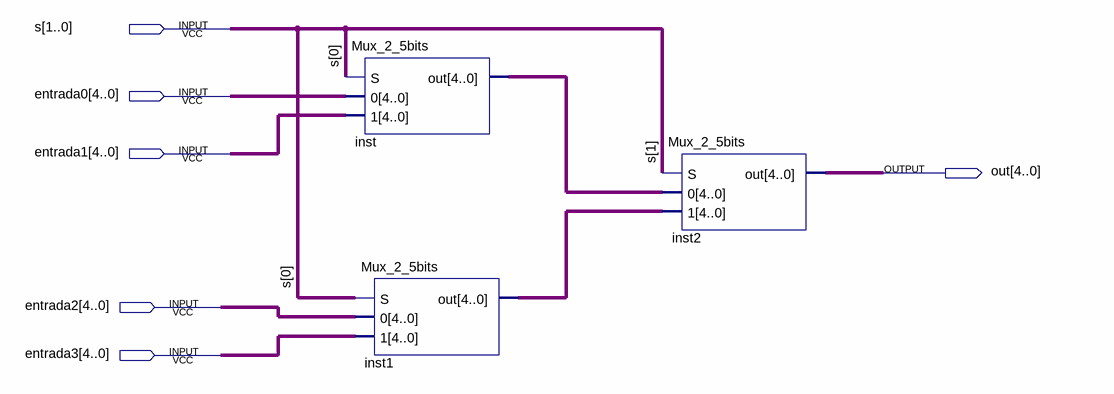
[diagram p0: schematic sheet]
// Quartus schematic Mux_4_5bits.bdf as structural Verilog: 3 symbols, 6 pins
module Mux_4_5bits (
  input  [1:0] s,
  input  [4:0] entrada0,
  input  [4:0] entrada1,
  input  [4:0] entrada2,
  input  [4:0] entrada3,
  output [4:0] out
);

  wire [4:0] inst1_out, inst_out;

  Mux_2_5bits inst (.S(s[0]), .\0 (entrada0), .\1 (entrada1), .out(inst_out));
  Mux_2_5bits inst1 (.S(s[0]), .\0 (entrada2), .\1 (entrada3), .out(inst1_out));
  Mux_2_5bits inst2 (.S(s[1]), .\0 (inst_out), .\1 (inst1_out), .out(out));
endmodule
